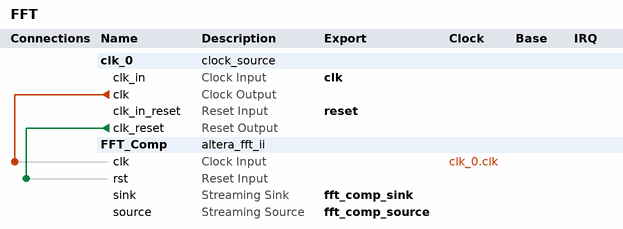
[diagram p0: system contents]
# Platform Designer (Qsys) system FFT, Cyclone V 5CEBA4F23C7
# Parameters at their usual value, and those the tool derives, are not listed.
package require -exact qsys 17.0
create_system FFT
set_project_property DEVICE_FAMILY {Cyclone V}
set_project_property DEVICE 5CEBA4F23C7

add_instance clk_0 clock_source 17.0
set_instance_parameter_value clk_0 clockFrequency 50000000

add_instance FFT_Comp altera_fft_ii 17.0
set_instance_parameter_value FFT_Comp data_flow {Variable Streaming}
set_instance_parameter_value FFT_Comp data_rep {Fixed Point}
set_instance_parameter_value FFT_Comp engine_arch {Quad Output}
set_instance_parameter_value FFT_Comp in_width 16
set_instance_parameter_value FFT_Comp length 256
set_instance_parameter_value FFT_Comp out_order {Digit Reverse}
set_instance_parameter_value FFT_Comp out_width 25
set_instance_parameter_value FFT_Comp twid_width 16

# connections
add_connection clk_0.clk FFT_Comp.clk clock
add_connection clk_0.clk_reset FFT_Comp.rst reset

# exported interfaces
add_interface clk clock sink
set_interface_property clk EXPORT_OF clk_0.clk_in
add_interface fft_comp_sink avalon_streaming sink
set_interface_property fft_comp_sink EXPORT_OF FFT_Comp.sink
add_interface fft_comp_source avalon_streaming source
set_interface_property fft_comp_source EXPORT_OF FFT_Comp.source
add_interface reset reset sink
set_interface_property reset EXPORT_OF clk_0.clk_in_reset

set_interconnect_requirement {$system} qsys_mm.clockCrossingAdapter HANDSHAKE
set_interconnect_requirement {$system} qsys_mm.enableEccProtection FALSE
set_interconnect_requirement {$system} qsys_mm.insertDefaultSlave FALSE
set_interconnect_requirement {$system} qsys_mm.maxAdditionalLatency 1

save_system FFT.qsys
